# EasyEDA schematic Sheet_1.json
TITLE: Sheet_1; REV: 1.0; Date: 2021-12-05; Sheet: 1/1; Drawn By: EDUARDO BLANCO; Company: Your Company
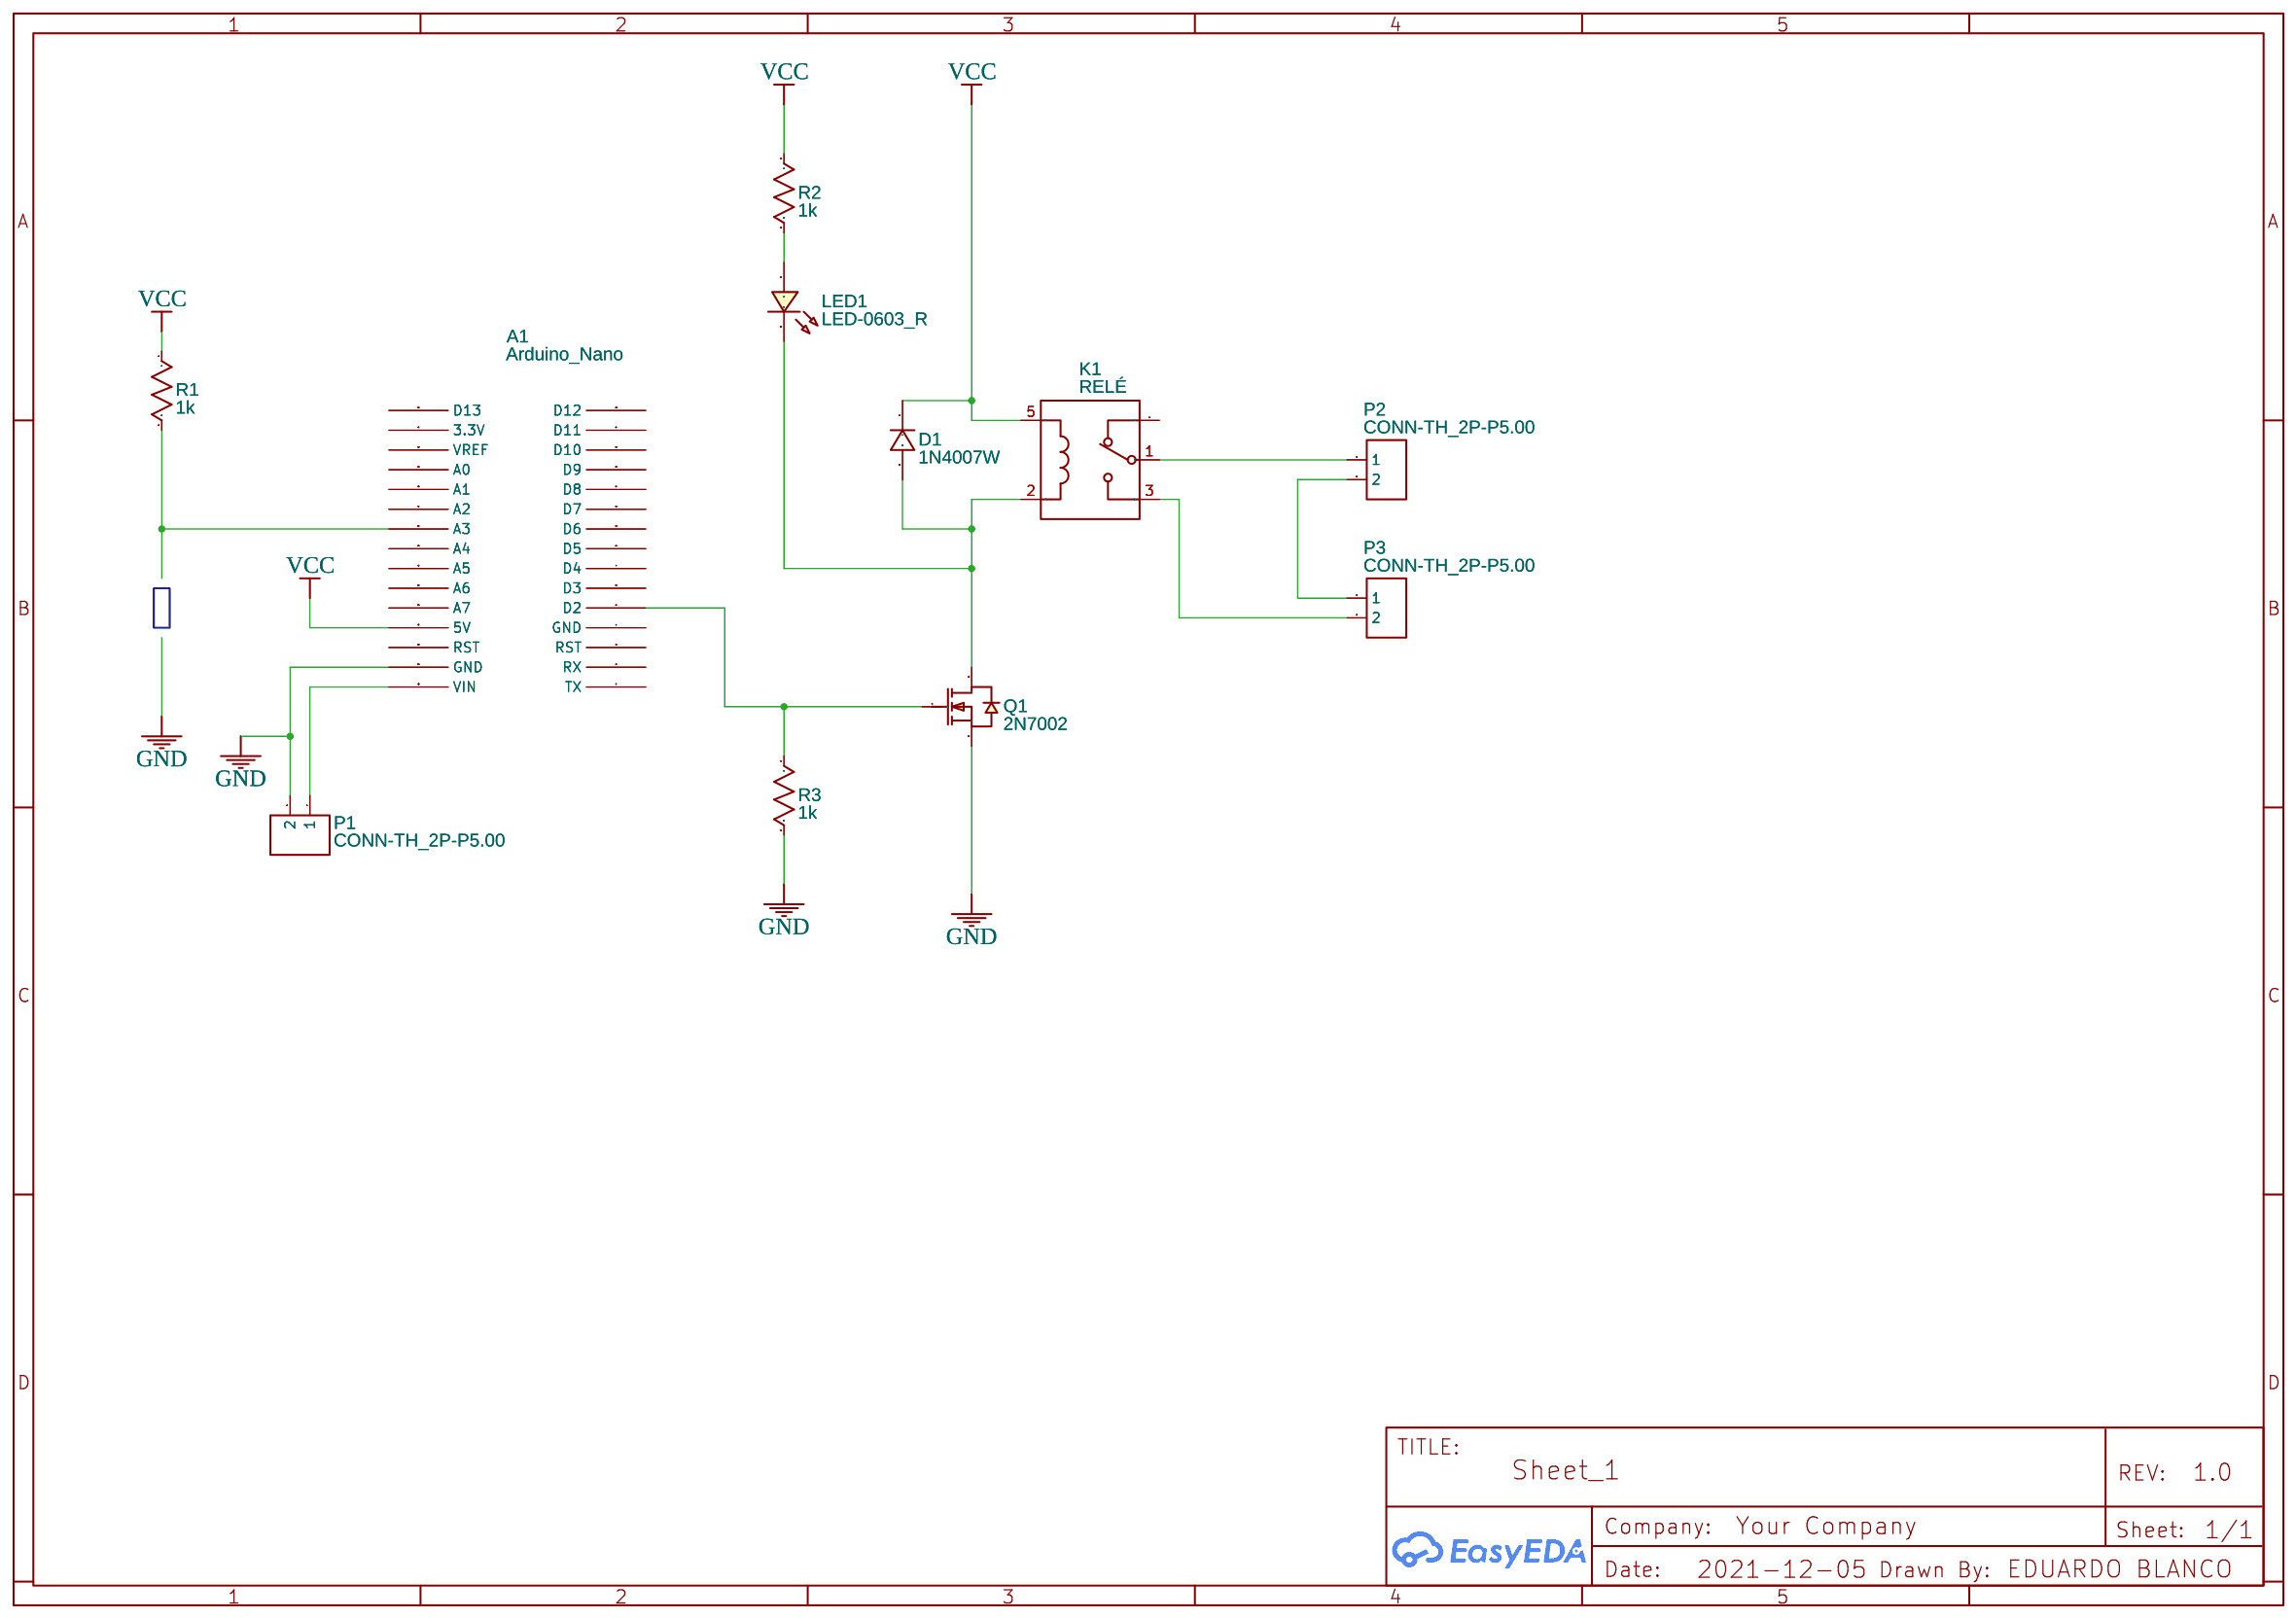
[diagram p0: schematic sheet]

## Parts
A1  Arduino_Nano  [ARDUINO_NANO WITH MOUNTING HOLES]
D1  1N4007W  [SOD-123_L2.8-W1.8-LS3.7-RD]
K1  RELÉ  [RELÉ_TH]
LED1  LED-0603_R  [LED0603_RED]
P1  CONN-TH_2P-P5.00  [CONN-TH_2P-P5.00]
P2  CONN-TH_2P-P5.00  [CONN-TH_2P-P5.00]
P3  CONN-TH_2P-P5.00  [CONN-TH_2P-P5.00]
Q1  2N7002  [SOT-23_L2.9-W1.3-P0.95-LS2.4-BR]
R1  1k  [R0603]
R2  1k  [R0603]
R3  1k  [R0603]

## Library data of the parts
A1 = -: Manufacturer Part: Arduino Nano; Contributor: CowboyWillT
D1 = 1N4007W: Supplier: LCSC; Supplier Part: C328592; Manufacturer: BLUE ROCKET; Contributor: LCEDA_Lib
K1 = RELÉ: Contributor: rafael santana
LED1 = LED-0603_R: Manufacturer: EVERLIGHT(台湾亿光); Manufacturer Part: 19-217/R6C-AL1M2VY/3T; Supplier Part: C72044; Supplier: LCSC; Contributor: LCEDA_01
P1-P3 = CONN-TH_2P-P5.00: Supplier: LCSC; Contributor: LCEDA_Lib
Q1 = 2N7002: Supplier: LCSC; Manufacturer: Nexperia; Manufacturer Part: 2N7002,215; image: //image.lceda.cn/szlcsc/C65189.jpg; Supplier Part: C65189; Paste Type: expand; Contributor: LCEDA_Lib
R1-R3 = R_0603_US: Contributor: LCEDA_Lib

## Nets
GND: A1.29(GND) P1.2 Q1.2(S) R3.2
VCC: A1.27(5V) D1.1 K1.5 R1.1 R2.1
Net-(A1-5): A1.5(D2) Q1.1(G) R3.1
Net-(A1-22): A1.22(A3) R1.2
Net-(A1-30): A1.30(VIN) P1.1
Net-(D1-2): D1.2 K1.2 LED1.2 Q1.3(D)
Net-(K1-1): K1.1 P2.1
Net-(K1-3): K1.3 P3.2
Net-(LED1-1): LED1.1 R2.2
Net-(P2-2): P2.2 P3.1

Not connected (* = marked no-connect by the designer): A1 1(TX) 2(RX) 3(RST) 4(GND) 6(D3) 7(D4) 8(D5) 9(D6) 10(D7) 11(D8) 12(D9) 13(D10) 14(D11) 15(D12) 16(D13) 17(3.3V) 18(VREF) 19(A0) 20(A1) 21(A2) 23(A4) 24(A5) 25(A6) 26(A7) 28(RST); K1 4
